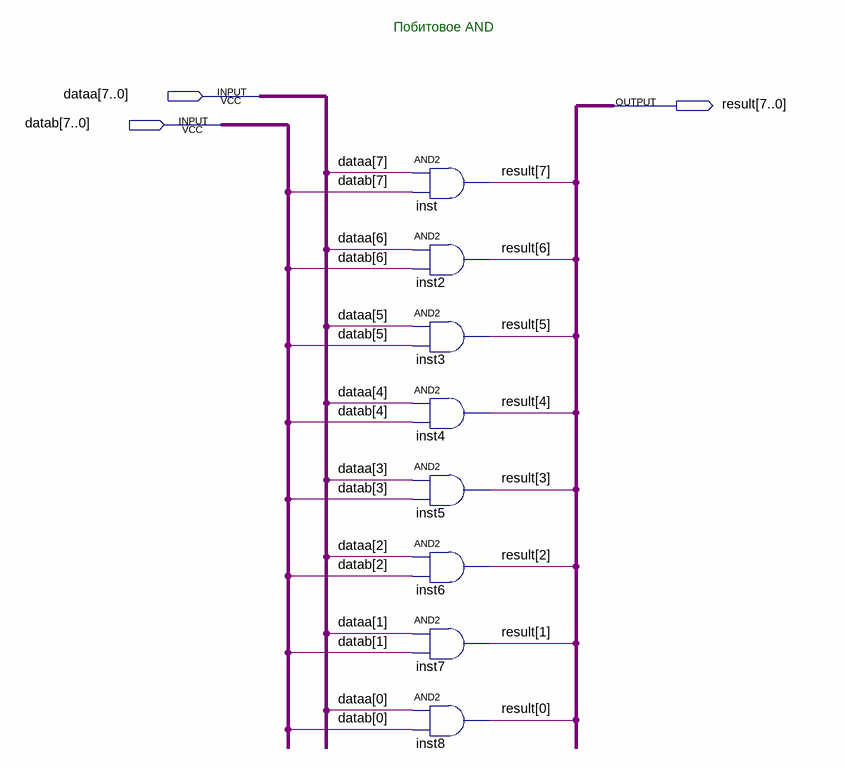
[diagram p0: schematic sheet]
// Quartus schematic alu_logic_and8.bdf as structural Verilog: 8 symbols, 3 pins
module alu_logic_and8 (
  input  [7:0] dataa,
  input  [7:0] datab,
  output [7:0] result
);

  and inst (result[7], dataa[7], datab[7]);
  and inst2 (result[6], dataa[6], datab[6]);
  and inst3 (result[5], dataa[5], datab[5]);
  and inst4 (result[4], dataa[4], datab[4]);
  and inst5 (result[3], dataa[3], datab[3]);
  and inst6 (result[2], dataa[2], datab[2]);
  and inst7 (result[1], dataa[1], datab[1]);
  and inst8 (result[0], dataa[0], datab[0]);

  // Notes on the sheet:
  //   Побитовое AND
endmodule
